# EAGLE schematic microSD_Breakout (EAGLE 6.1)
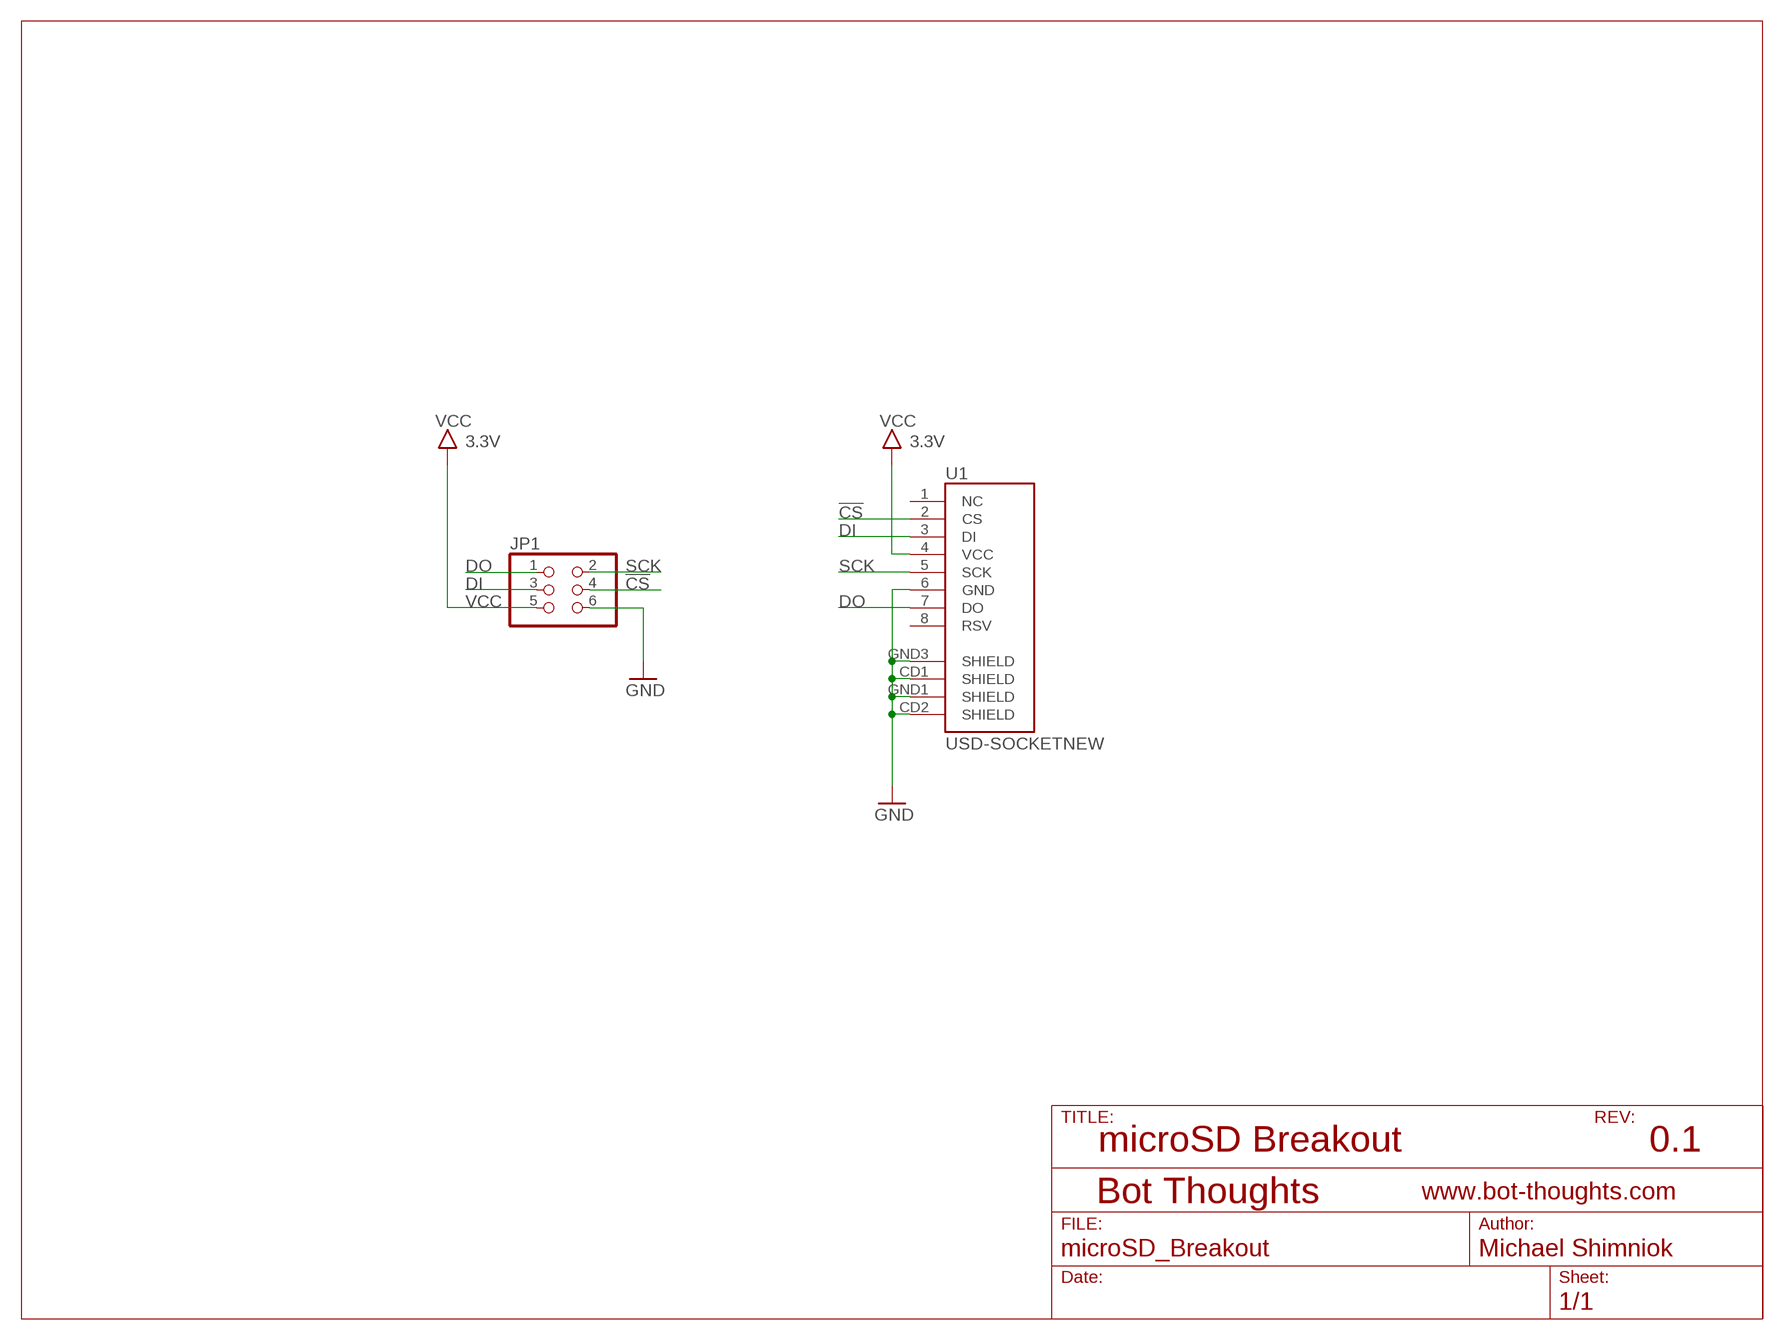
[diagram p0: schematic, sheet 1]

## Parts
JP1  PINHD-2X03_2.54  [2X03]
U1  USD-SOCKETNEW  [MICRO-SD-SOCKET-PP]

## Nets
!CS: JP1.4 U1.2(CS)
DI: JP1.3 U1.3(DI)
DO: JP1.1 U1.7(DO)
GND: JP1.6 U1.6(GND) U1.CD1(SHIELD) U1.CD2(SHIELD) U1.GND1(SHIELD) U1.GND3(SHIELD)
SCK: JP1.2 U1.5(SCK)
VCC: JP1.5 U1.4(VCC) ; supply symbol labelled 3.3V
Unconnected: U1.1(NC) U1.8(RSV)

## Notes on the sheet
- microSD Breakout | 0.1

## Library data of the parts
JP1 = pinhead-2:PINHD-2X03: PIN HEADER
U1 = SparkFun:USD-SOCKET: microSD Socket Push-push type uSD socket. Schematic element and footprint production proven. Spark Fun Electronics SKU : PRT-00127. tDoc lines correctly indicate media card edge positions when inserting (unlocked, locked, depressed).